# EAGLE design ws8731_breakout_board (EAGLE 9.6.2)
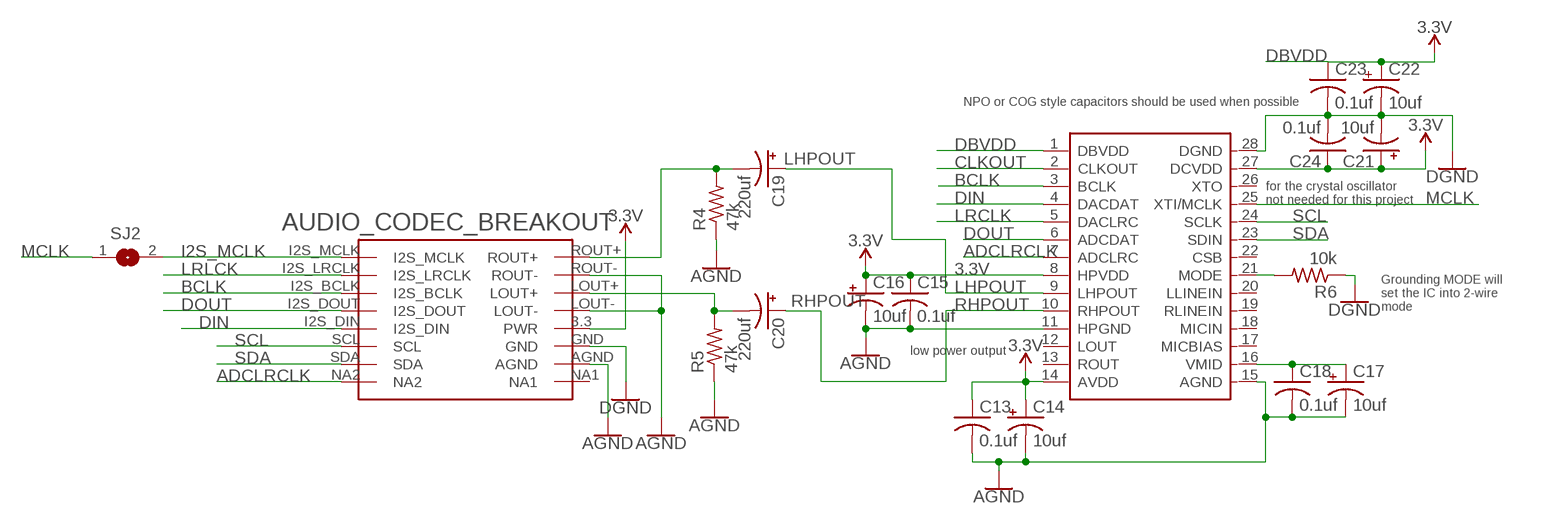
[diagram p0: schematic, sheet 1]

## Parts
C13  0.1uf  C-USC0805K  [C0805K]
C14  10uf  CPOL-US153CLV-0505  [153CLV-0505]
C15  0.1uf  C-USC0805K  [C0805K]
C16  10uf  CPOL-US153CLV-0505  [153CLV-0505]
C17  10uf  CPOL-US153CLV-0505  [153CLV-0505]
C18  0.1uf  C-USC0805K  [C0805K]
C19  220uf  47UF-POLAR-PANASONIC_D-50V-20%  [PANASONIC_D]
C20  220uf  47UF-POLAR-PANASONIC_D-50V-20%  [PANASONIC_D]
C21  10uf  CPOL-US153CLV-0505  [153CLV-0505]
C22  10uf  CPOL-US153CLV-0505  [153CLV-0505]
C23  0.1uf  C-USC0805K  [C0805K]
C24  0.1uf  C-USC0805K  [C0805K]
R4  47k  R-US_R0805  [R0805]
R5  47k  R-US_R0805  [R0805]
R6  10k  R-US_R0805  [R0805]
SJ2  SJ  [SJ]
U2  CODECODER-WM8731SEDS/V(SSOP28)  [SSOP28-0.65-10.2X5.2MM]
U$12  AUDIO_CODEC_BREAKOUT  [HSS_CODEC_BREAKOUT]

## Nets
3.3V: C13.1 C14.+ C15.1 C16.+ C21.+ C24.1 U2.8(HPVDD) U2.14(AVDD) U2.27(DCVDD) U$12.3.3(PWR)
ADCLRCLK: U2.7(ADCLRC) U$12.NA2
AGND: C13.2 C14.- C15.2 C16.- C17.- C18.2 R4.1 R5.1 U2.11(HPGND) U2.15(AGND) U$12.AGND U$12.LOUT- U$12.ROUT-
BCLK: U2.3(BCLK) U$12.I2S_BCLK
CLKOUT: U2.2(CLKOUT)
DBVDD: C22.+ C23.1 U2.1(DBVDD) ; supply symbol labelled 3.3V
DGND: C21.- C22.- C23.2 C24.2 R6.1 U2.28(DGND)
DIN: U2.4(DACDAT) U$12.I2S_DIN
DOUT: U2.6(ADCDAT) U$12.I2S_DOUT
GND: U$12.GND ; supply symbol labelled DGND
I2S_MCLK: SJ2.2 U$12.I2S_MCLK
LHPOUT: C19.+ U2.9(LHPOUT)
LRCLK: U2.5(DACLRC)
LRLCK: U$12.I2S_LRCLK
MCLK: SJ2.1 U2.25(XTI/MCLK)
MODE1: R6.2 U2.21(MODE)
N$2: C17.+ C18.1 U2.16(VMID)
N$3: C20.- R5.2 U$12.LOUT+
N$4: C19.- R4.2 U$12.ROUT+
RHPOUT: C20.+ U2.10(RHPOUT)
SCL: U2.24(SCLK) U$12.SCL
SDA: U2.23(SDIN) U$12.SDA
Unconnected: U2.12(LOUT) U2.13(ROUT) U2.17(MICBIAS) U2.18(MICIN) U2.19(RLINEIN) U2.20(LLINEIN) U2.22(CSB) U2.26(XTO) U$12.NA1

## Notes on the sheet
- NPO or COG style capacitors should be used when possible
- for the crystal oscillator
  not needed for this project
- Grounding MODE will
  set the IC into 2-wire
  mode
- low power output

## Library data of the parts
C13 C15 C18 C23 C24 = adafruit:C-US: CAPACITOR, American symbol
C14 C16 C17 C21 C22 = adafruit-with-additions:CPOL-US: POLARIZED CAPACITOR, American symbol
C19 C20 = SparkFun-Capacitors:47UF-POLAR: 47µF polarized capacitors A capacitor is a passive two-terminal electrical component used to store electrical energy temporarily in an electric field.
R4-R6 = rcl:R-US_: RESISTOR, American symbol; SPICEPREFIX: R
SJ2 = jumper:SJ: SMD solder JUMPER
U2 = CODECODER-WM8731SEDS_V_SSOP28_:CODECODER-WM8731SEDS/V(SSOP28): 310080003 Check prices <https://pricing.snapeda.com/parts/WM8731SEDS/V/Cirrus%20Logic/view-part?ref=eda>; AVAILABILITY: Warning; DESCRIPTION: Audio Interface 24 b Serial 28-SSOP; MF: Cirrus Logic; MP: WM8731SEDS/V; PACKAGE: SSOP-28 Cirrus Logic; PRICE: None; PURCHASE-URL: https://pricing.snapeda.com/search/part/WM8731SEDS/V/?ref=eda
U$12 = nathans-custom-parts:AUDIO_CODEC_BREAKOUT

## Board
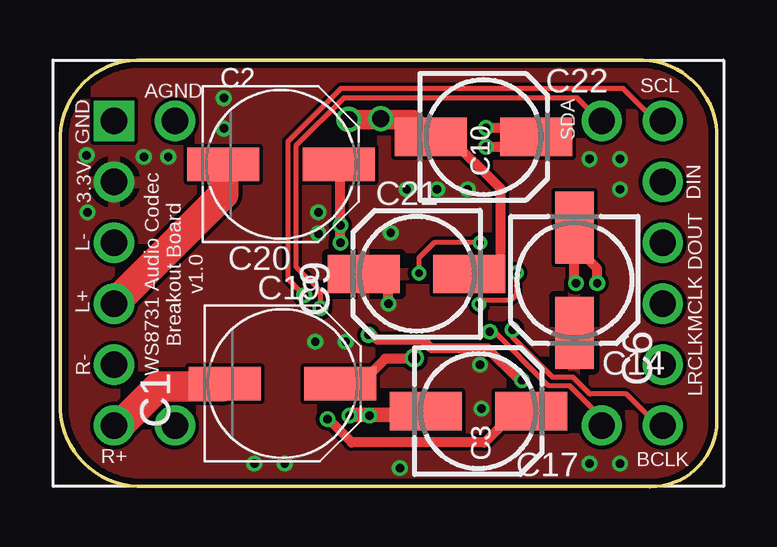
[diagram p1: board, top side]
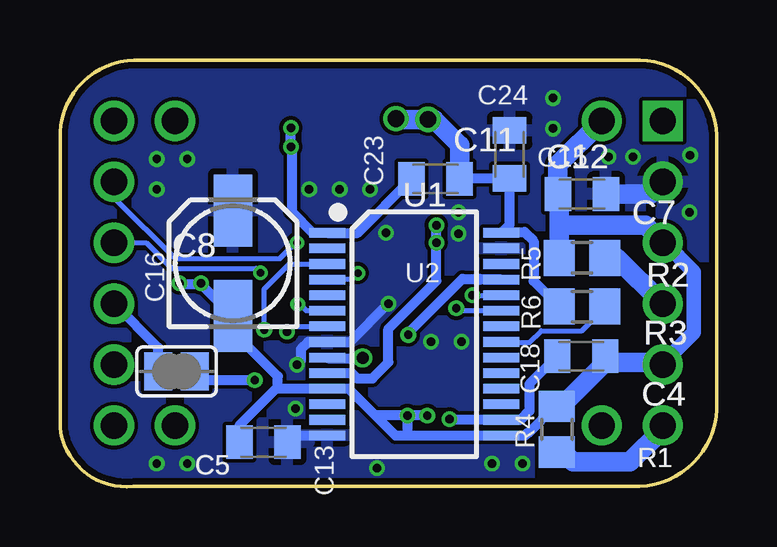
[diagram p2: board, bottom side, seen from below]

Size 27.37 x 17.8 mm. Coordinates in mm from the lower left corner, seen from the top.
Outline: 23.98,17.79 3.52,17.79 arc90 0,14.65 0,3.22 arc90 3.52,0.01 24.32,0.01 arc90 27.37,2.49 27.37,14.79 arc90 23.98,17.79
Copper layers (1*16): Top 0.035mm / dielectric 1.5mm / Bottom 0.035mm
Design rules "SeeedStudio_2layer_DRU_no_angle_20140221": minimum track width 6mil, minimum drill 12mil, track to track 6mil, track to pad 6mil, pad to pad 6mil, via to via 6mil, smd to smd 0mil, copper to edge 10mil, drill to drill 10mil, minimum pad ring 10mil, minimum via ring 6mil, stop-mask expansion 2mil, vias tented up to drill 100mil, thermal gap 10mil

### Footprints (pad centres in the part's own frame; a part is rotated, then mirrored left to right if it is on the bottom)
C0805K = smd 1.1 x 1.4: 1 -1,0; 2 1,0
153CLV-0505 = smd 3 x 1.6: + 2.2,0; - -2.2,0
PANASONIC_D = smd 3 x 1.4: + 2.4,0; - -2.4,0
R0805 = smd 1.3 x 1.5: 1 -0.95,0; 2 0.95,0
SJ = smd 1.168 x 1.6: 1 -0.762,0; 2 0.762,0
SSOP28-0.65-10.2X5.2MM = smd 0.4 x 1.5: 1 -4.225,-3.625; 2 -3.575,-3.625; 3 -2.925,-3.625; 4 -2.275,-3.625; 5 -1.625,-3.625; 6 -0.975,-3.625; 7 -0.325,-3.625; 8 0.325,-3.625; 9 0.975,-3.625; 10 1.625,-3.625; 11 2.275,-3.625; 12 2.925,-3.625; 13 3.575,-3.625; 14 4.225,-3.625; 15 4.225,3.625; 16 3.575,3.625; 17 2.925,3.625; 18 2.275,3.625; 19 1.625,3.625; 20 0.975,3.625; 21 0.325,3.625; 22 -0.325,3.625; 23 -0.975,3.625; 24 -1.625,3.625; 25 -2.275,3.625; 26 -2.925,3.625; 27 -3.575,3.625; 28 -4.225,3.625
HSS_CODEC_BREAKOUT = drill 1.1 pad 1.676: 3.3 -11.43,3.81; AGND -8.89,6.35; I2S_BCLK 11.43,-6.35; I2S_DIN 11.43,3.81; I2S_DOUT 11.43,1.27; I2S_LRCLK 11.43,-3.81; I2S_MCLK 11.43,-1.27; LOUT+ -11.43,-1.27; LOUT- -11.43,1.27; NA1 -8.89,-6.35; NA2 8.89,-6.35; ROUT+ -11.43,-6.35; ROUT- -11.43,-3.81; SCL 11.43,6.35; SDA 8.89,6.35 | drill 1.1 pad 1.676 square: GND -11.43,6.35

### Placement (x,y rotation side)
C13  18.89,1.86 180 bottom
C14  21.43,8.62 270 top
C15  5.62,12.21 180 bottom
C16  20.16,9.32 90 bottom
C17  17.43,3.16 0 top
C18  5.65,5.44 0 bottom
C19  9.27,4.3 0 top
C20  9.21,13.44 0 top
C21  14.86,8.87 180 top
C22  17.65,14.59 0 top
C23  11.72,12.84 0 bottom
C24  8.64,13.86 270 bottom
R4  6.67,2.4 270 bottom
R5  5.62,9.54 0 bottom
R6  5.62,7.51 0 bottom
SJ2  22.51,4.81 180 bottom
U2  12.6,6.36 270 bottom
U$12  13.68,8.9 0 top

### Tracks (layer width: path | path; a pad name or v marks a point on that pad's centre or on a via)
3.3V  (via drill 0.35)
  Top 0.406: v13.68,7.63 13.68,8.9 12.69,8.9 C21.+ | C14.+ 21.37,6.48 21.37,7.19
  Bottom 0.406: C13.1 17.61,2.14 U2.14 | v17.49,5.09 17.34,5.25 17.34,5.74 17.03,6.04 U2.8 15.28,6.04 v13.68,7.63
  Bottom 0.813: C15.1 2.76,12.21 U$12.3.3
  other vias: 10.76,10.56 10.76,11.44 13.78,10.59 10.64,6.05 11.91,6.05 8.1,0.97 9.37,0.97 22.07,0.97 23.34,0.97 14.45,12.4 15.72,12.4 6.83,14.94 6.83,16.21 23.34,13.67 23.34,12.4 22.07,13.67 16.99,12.4 17.56,3.25 14.16,0.78 3.49,13.76 4.51,13.76 1.11,13.83 1.14,11.44
  pour Top: 26.92,3 26.92,14.8 arc90 23.9,17.83 3.66,17.83 arc90 0.25,14.42 0.25,3.38 arc90 3.62,0.01 23.94,0.01 arc90
  pour Bottom: 26.92,3 26.92,14.81 arc90 23.94,17.79 3.56,17.79 arc90 0.32,14.56 0.32,3.25 arc90 3.56,0.01 23.94,0.01 arc90
ADCLRCLK  (via drill 0.35)
  Top 0.203: v17.91,6.46 18,6.55 20.35,4.21 21.24,4.21 22.57,2.87 U$12.NA2
  Bottom 0.203: v17.91,6.46 17.69,6.68 U2.7
AGND  (via drill 0.35)
  Top 0.406: 12.1,3 v12.07,2.97 | v12.89,2.97 15.04,2.97 C17.- | v21.49,8.49 21.43,8.56 21.43,10.05 | 21.43,10.05 21.43,10.28 | v22.38,8.49 22.38,9.1 21.43,10.05
  Top 0.61: C17.- 15.07,3 12.1,3
  Top 1.27: 21.43,10.28 C14.-
  Bottom 0.406: R4.1 6.75,3.35 7.86,2.23 7.91,2.23 8,2.14 U2.15 12.89,2.14 | 18.29,4.15 18.29,4.61 20.16,6.48 C16.- 21.49,8.45 | C13.2 19.89,2.55 18.29,4.15 | 12.89,2.14 13.4,2.14 14.24,2.98 | 14.24,2.98 15.35,4.09 U2.11 18.22,4.09 18.29,4.15 | v12.07,2.97 12.08,2.98 14.24,2.98 | v12.89,2.97 12.89,2.14 | 21.49,8.45 v21.49,8.49 | v22.38,8.49 22.34,8.45 21.49,8.45
  Bottom 0.61: U$12.ROUT- 2.25,5.14 0.96,6.43 0.96,8.96 2.17,10.17 U$12.LOUT-
  Bottom 0.813: U$12.ROUT- 2.35,5.19 4.4,5.19 C18.2 4.65,5.18 6.49,3.35 R4.1 | R5.1 6.57,10.9 | 6.57,10.9 6.57,12.16 C15.2 6.62,13.43 U$12.AGND | U$12.LOUT- 2.98,10.9 6.57,10.9
BCLK  (via drill 0.35)
  Top 0.203: U$12.I2S_BCLK 24.91,2.55 23.6,3.87 22.08,3.87 21.38,4.57 20.53,4.57 18.86,6.23 v18.86,6.55
  Bottom 0.203: v18.86,6.55 18.86,8.24 17.81,9.29 U2.3
DBVDD  (via drill 0.35)
  Top 0.406: v17.75,14.18 19.44,14.18 C22.+ 19.47,14.97 v17.75,14.97
  Bottom 0.406: C23.1 14.97,10.59 U2.1 16.83,10.59 17.72,11.47 17.72,14.14 v17.75,14.18 v17.75,14.97
DGND  (via drill 0.7)
  Top 0.406: C22.- 16.21,14.59 18.36,12.44 18.36,8.9 18.32,8.87 C21.-
  Top 0.813: C22.- 14.72,15.32 v12.03,15.32
  Bottom 0.406: C23.2 10.7,12.86 C24.2 8.64,10.93 U2.28 8.95,10.62 8.02,10.62 7.64,10.24 7.64,8.58 R6.1
  Bottom 0.813: C23.2 10.72,14.25 11.78,15.32 v12.03,15.32 13.34,15.32 v13.37,15.35
DIN  (via drill 0.3)
  Top 0.203: v17.49,10.17 15.59,10.17 14.95,9.54 v14.95,8.9
  Bottom 0.203: v17.49,10.17 17.54,10.17 18.21,9.51 22.58,9.51 25.11,12.05 U$12.I2S_DIN | v14.95,8.9 15.22,8.64 U2.4
DOUT  (via drill 0.3)
  Top 0.203: v19.02,8.92 v19,8.91 19,8 18.78,7.77 17.62,7.77 v17.46,7.62
  Bottom 0.203: U$12.I2S_DOUT 23.78,10.17 22.72,9.11 19.21,9.11 v19.02,8.92 | v17.46,7.62 17.39,7.62 17.12,7.34 U2.6
I2S_MCLK
  Bottom 0.406: SJ2.2 23.27,5.79 U$12.I2S_MCLK
LHPOUT  (via drill 0.5)
  Top 0.406: v14.76,5.37 14.76,5.34 13.55,5.34 12.51,4.3 C19.+
  Bottom 0.406: U2.9 16.2,5.36 14.77,5.36 v14.76,5.37
MCLK  (via drill 0.35)
  Top 0.406: v12.86,6.33 13.02,6.33 13.22,6.13 15.12,6.13 15.47,5.78 17.81,5.78 19.15,4.44 v19.25,4.44
  Bottom 0.406: U2.25 9.87,8.64 9.9,8.67 10.6,8.67 12.86,6.41 v12.86,6.33 | v19.25,4.44 21.38,4.44 SJ2.1
MODE1
  Bottom 0.203: U2.21 8.95,6.01 7.81,6.01 7.32,6.5 5.62,6.5 4.67,7.46 R6.2
N$2  (via drill 0.35)
  Top 0.406: v11.14,2.82 11.18,2.82 12.15,1.84 17.67,1.84 17.67,1.83 19,3.16 C17.+
  Bottom 0.406: C18.1 7.81,4.28 7.81,3.16 8.18,2.79 U2.16 11.11,2.79 v11.14,2.82
N$3
  Top 1.27: C20.- 6.81,12.19 U$12.LOUT+
  Bottom 0.813: R5.2 4.16,9.54 U$12.LOUT+
N$4
  Top 1.27: C19.- 6.75,4.18 4.12,4.18 2.5,2.55 U$12.ROUT+
  Bottom 0.813: R4.2 6.39,1.45 5.98,1.03 3.62,1.03 2.25,2.4 U$12.ROUT+
RHPOUT  (via drill 0.35)
  Top 0.406: C20.+ 11.68,13.37 v11.68,10.9 v11.68,10.17
  Bottom 0.406: U2.10 15.2,4.74 14.98,4.52 14.36,4.52 13.68,5.19 13.68,6.59 11.68,8.59 v11.68,10.9
SCL  (via drill 0.35)
  Top 0.203: U$12.SCL 24.82,15.25 23.47,16.6 11.7,16.6 9.5,14.4 9.5,8.66 v10.18,7.98
  Bottom 0.203: v10.18,7.98 U2.24
SDA  (via drill 0.35)
  Top 0.203: U$12.SDA 22.51,15.25 21.55,16.21 11.82,16.21 9.85,14.25 9.85,9.15 10.86,8.14 v10.86,7.44
  Bottom 0.203: v10.86,7.44 10.76,7.35 8.99,7.35 U2.23

### Text on the board
tNames: AGND | SCL | GND | SDA | 3.3V | DIN | L- | DOUT | WS8731 Audio Codec / Breakout Board / v1.0 | L+ | MCLK | R- | LRCLK | R+ | BCLK
_tNames: C2 | C2 | C2 | C10 | C10 | C10 | C9 | C9 | C9 | C6 | C6 | C6 | C3 | C3 | C3 | C1 | C1 | C1
_bNames: C12 | C12 | C12 | C11 | C11 | C11 | U1 | U1 | U1 | C7 | C7 | C7 | C8 | C8 | C8 | R2 | R2 | R2 | R3 | R3 | R3 | C4 | C4 | C4 | R1 | R1 | R1 | C5 | C5 | C5